# Altium schematic sheet Top.SchDoc
size A4
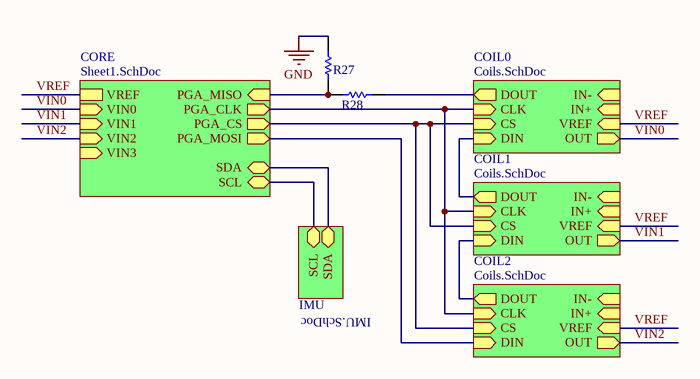
[diagram p0: Top.SchDoc]

## Parts
R27  10K 1% 0402(1005)  [RESC0402(1005)_N]  (value not drawn)
R28  5K6 5% 0402(1005)  [RESC0402(1005)_N]  (value not drawn)

## Sub-sheets
COIL0 = Coils.SchDoc: DIN (in), CLK (in), CS (in), DOUT (out), OUT (out), IN- (in), IN+ (in), VREF (in)
COIL1 = Coils.SchDoc: DIN (in), CLK (in), CS (in), DOUT (out), OUT (out), IN- (in), IN+ (in), VREF (in)
COIL2 = Coils.SchDoc: DIN (in), CLK (in), CS (in), DOUT (out), OUT (out), IN- (in), IN+ (in), VREF (in)
CORE = Sheet1.SchDoc: SDA (bidir), SCL (bidir), PGA_CLK (out), PGA_MISO (in), PGA_MOSI (out), VREF, VIN0 (in), VIN1 (in), VIN2 (in), VIN3 (in), PGA_CS (out)
IMU = IMU.SchDoc: SDA (bidir), SCL (bidir)

## Nets
GND: R27.1
VIN0: sheet CORE/VIN0, sheet COIL0/OUT
VIN1: sheet CORE/VIN1, sheet COIL1/OUT
VIN2: sheet CORE/VIN2, sheet COIL2/OUT
VREF: sheet CORE/VREF, sheet COIL0/VREF, sheet COIL1/VREF, sheet COIL2/VREF
NetR27_2: R27.2 R28.1 ; sheet CORE/PGA_MISO
NetR28_2: R28.2 ; sheet COIL0/DOUT
(unnamed): sheet CORE/SDA, sheet IMU/SDA
(unnamed): sheet CORE/SCL, sheet IMU/SCL
(unnamed): sheet CORE/PGA_CLK, sheet COIL0/CLK, sheet COIL1/CLK, sheet COIL2/CLK
(unnamed): sheet CORE/PGA_MOSI, sheet COIL2/DIN
(unnamed): sheet CORE/PGA_CS, sheet COIL0/CS, sheet COIL1/CS, sheet COIL2/CS
(unnamed): sheet COIL0/DIN, sheet COIL1/DOUT
(unnamed): sheet COIL1/DIN, sheet COIL2/DOUT

## Library data of the parts
R27 = CMP-1011-00623-1: 10K 0.063W 1% 0402 (1005 Metric)  SMD; Case-Metric: 1005; Value: 10000.00 Ohm; Case-EIA: 0402; Tolerance: 1 %; Technology: SMT; Power: 0.063 W
R28 = CMP-1011-00092-1: 5K6 0.063W 5% 0402 (1005 Metric)  SMD; Case-EIA: 0402; Case-Metric: 1005; Value: 5600.00 Ohm; Technology: SMT; Tolerance: 5 %; Power: 0.063 W